# EAGLE design PowerDistribution2022 (EAGLE 9.6.2)
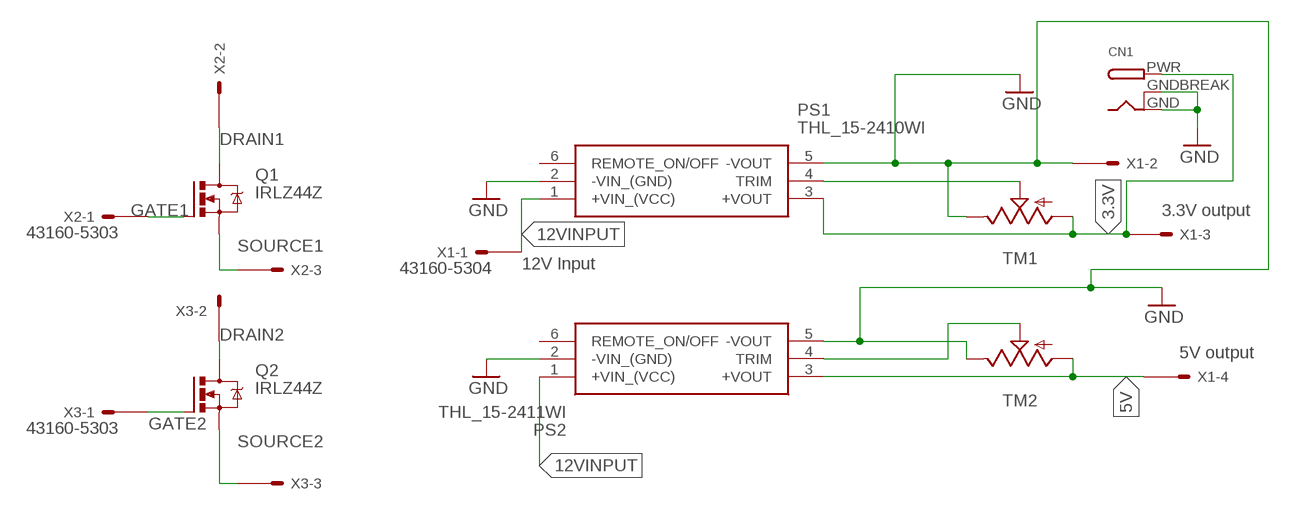
[diagram p0: schematic, sheet 1]

## Parts
CN1  DCBARRELPTH  [DCJACK_2MM_PTH]
PS1  THL_15-2410WI  [THL152410WI]
PS2  THL_15-2411WI  [THL152411WI]
Q1  IRLZ44Z  [TO220BH]
Q2  IRLZ44Z  [TO220BH]
TM1  TRIM  [6MM]
TM2  TRIM  [6MM]
X1  43160-5304  [43160-XX04]
X2  43160-5303  [43160-XX03]
X3  43160-5303  [43160-XX03]

## Nets
3.3V: CN1.PWR PS1.3(+VOUT) TM1.A X1.3@1(-3:S)
5V: PS2.3(+VOUT) TM2.A X1.4@1(-4:S)
12VINPUT: PS1.1(+VIN_(VCC)) PS2.1(+VIN_(VCC)) X1.1@1(-1:S)
DRAIN1: Q1.D X2.2@1(-2:S)
DRAIN2: Q2.D X3.2@1(-2:S)
GATE1: Q1.G X2.1@1(-1:S)
GATE2: Q2.G X3.1@1(-1:S)
GND: CN1.GND CN1.GNDBREAK PS1.2(-VIN_(GND)) PS1.5(-VOUT) PS2.2(-VIN_(GND)) PS2.5(-VOUT) TM1.E TM2.E X1.2@1(-2:S)
N$1: PS1.4(TRIM) TM1.S
N$4: PS2.4(TRIM) TM2.S
SOURCE1: Q1.S X2.3@1(-3:S)
SOURCE2: Q2.S X3.3@1(-3:S)
Unconnected: PS1.6(REMOTE_ON/OFF) PS2.6(REMOTE_ON/OFF) X1.1@2(-1:S) X1.2@2(-2:S) X1.3@2(-3:S) X1.4@2(-4:S) X2.1@2(-1:S) X2.2@2(-2:S) X2.3@2(-3:S) X3.1@2(-1:S) X3.2@2(-2:S) X3.3@2(-3:S)

## Notes on the sheet
- 3.3V output
- 12V Input
- 5V output

## Library data of the parts
CN1 = adafruit:DCBARREL: 2.0mm DC Barrel Jack DCJACK_2MM_PTH - Through Hole Jack (4UConnector: 05537)
PS1 = SamacSys_Parts:THL_15-2410WI: 15 Watt DC/DC converter, industrial, 4:1 input, cost efficient design, encapsulated, 1" x 1" metal package Source: Datasheet <https://tracopower.com/thl15wi-datasheet/>; DESCRIPTION: 15 Watt DC/DC converter, industrial, 4:1 input, cost efficient design, encapsulated, 1" x 1" metal package; HEIGHT: 10.66mm; MANUFACTURER_NAME: Traco Power; MANUFACTURER_PART_NUMBER: THL 15-2410WI; MOUSER_PART_NUMBER: 495-THL15-2410WI; MOUSER_PRICE-STOCK: https://www.mouser.co.uk/ProductDetail/TRACO-Power/THL-15-2410WI/?qs=vLWxofP3U2zUD2qGlvCiuw%3D%3D
PS2 = SamacSys_Parts:THL_15-2411WI: 15 Watt DC/DC converter, industrial, 4:1 input, cost efficient design, encapsulated, 1" x 1" metal package Source: Datasheet <https://tracopower.com/thl15wi-datasheet/>; DESCRIPTION: 15 Watt DC/DC converter, industrial, 4:1 input, cost efficient design, encapsulated, 1" x 1" metal package; HEIGHT: 10.66mm; MANUFACTURER_NAME: Traco Power; MANUFACTURER_PART_NUMBER: THL 15-2411WI; MOUSER_PART_NUMBER: 495-THL15-2411WI; MOUSER_PRICE-STOCK: https://www.mouser.co.uk/ProductDetail/TRACO-Power/THL-15-2411WI?qs=vLWxofP3U2zTxW0y6%2FAPOg%3D%3D
Q1 Q2 = IRLZ44Z:IRLZ44Z: N-Channel HEXFET® Power MOSFET Logic Level AUTOMOTIVE MOSFET Source: http://www.irf.com/product-info/datasheets/data/irlz44zpbf.pdf Check availability <https://pricing.snapeda.com/parts/IRLZ44Z/Infineon%20Technologies/view-part?ref=eda>; AVAILABILITY: In Stock; DESCRIPTION: N-Channel 55 V 51A (Tc) 80W (Tc) Through Hole TO-220AB; MF: Infineon Technologies; MP: IRLZ44Z; PACKAGE: TO-220 Vishay; PRICE: None; PURCHASE-URL: https://pricing.snapeda.com/search/part/IRLZ44Z/?ref=eda
TM1 TM2 = adafruit:TRIM
X1 = con-molex:43160-*04: SDA-43160 Connector Source: http://www.molex.com/pdm_docs/sd/431601306_sd.pdf; MF: MOLEX; MPN: 43160-5304; OC_FARNELL: unknown; OC_NEWARK: 92M1500
X2 X3 = con-molex:43160-*03: SDA-43160 Connector Source: http://www.molex.com/pdm_docs/sd/431601306_sd.pdf; MF: MOLEX; MPN: 43160-5303; OC_FARNELL: unknown; OC_NEWARK: 92M1499

## Board
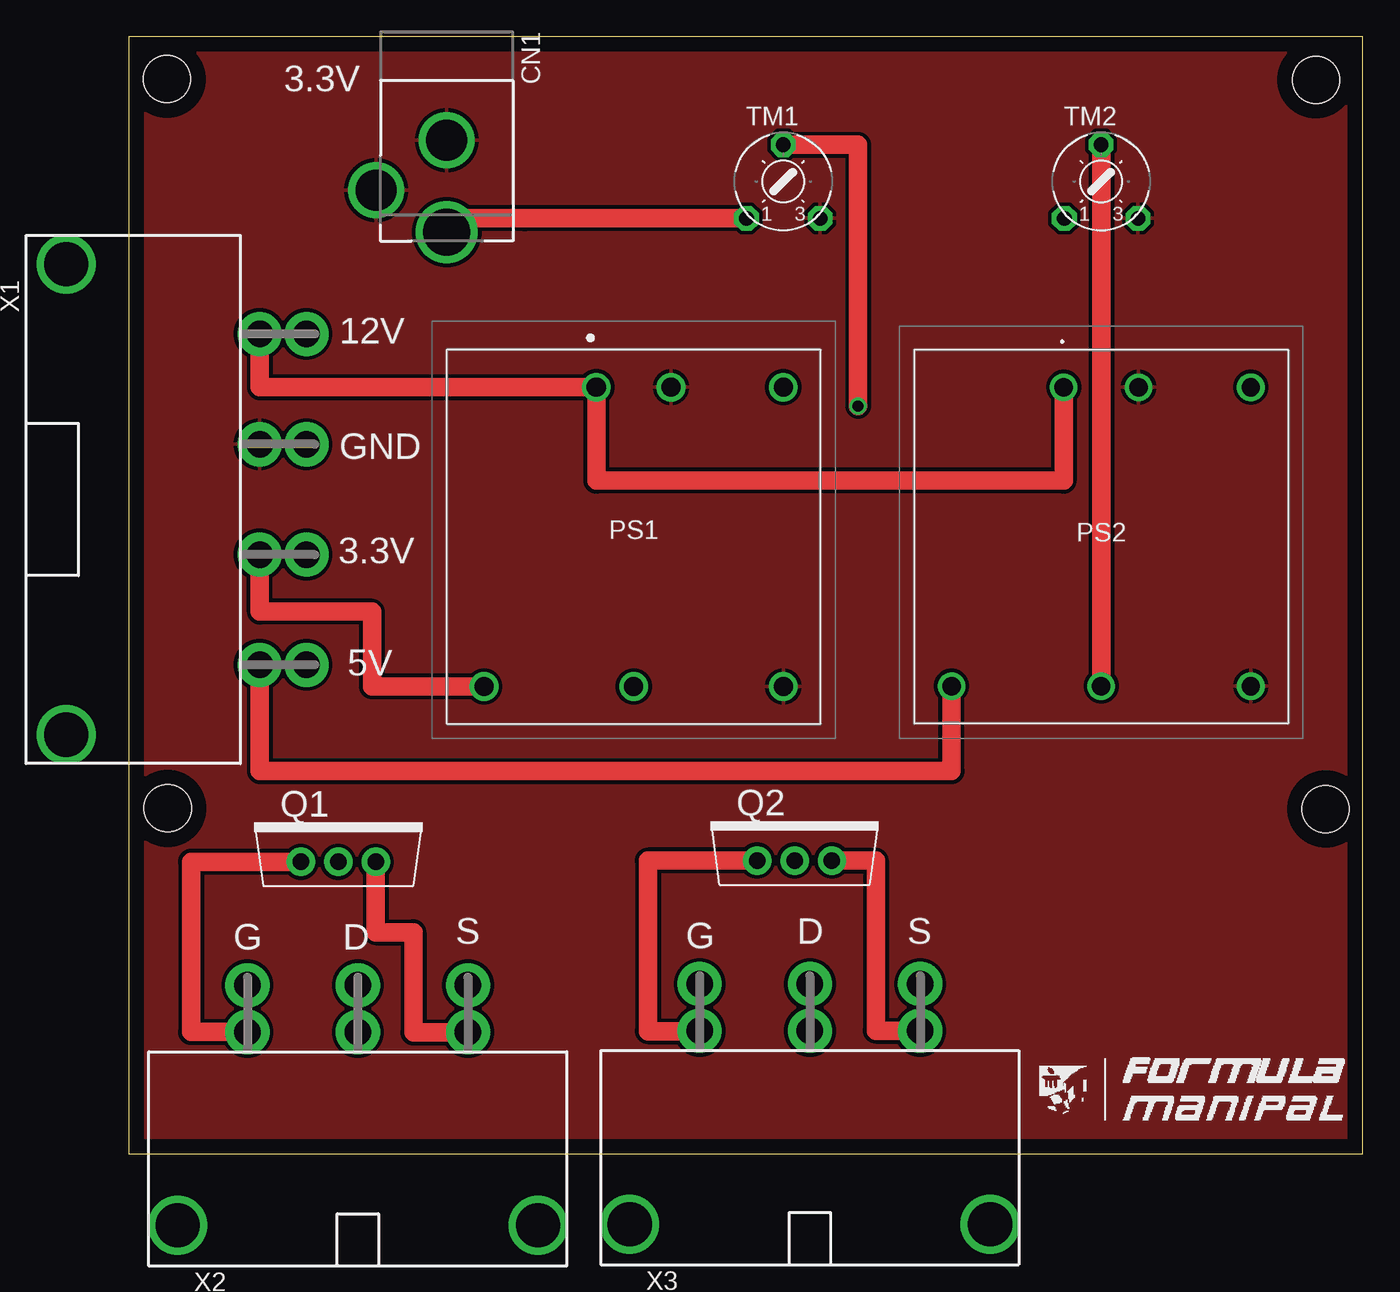
[diagram p1: board, top side]
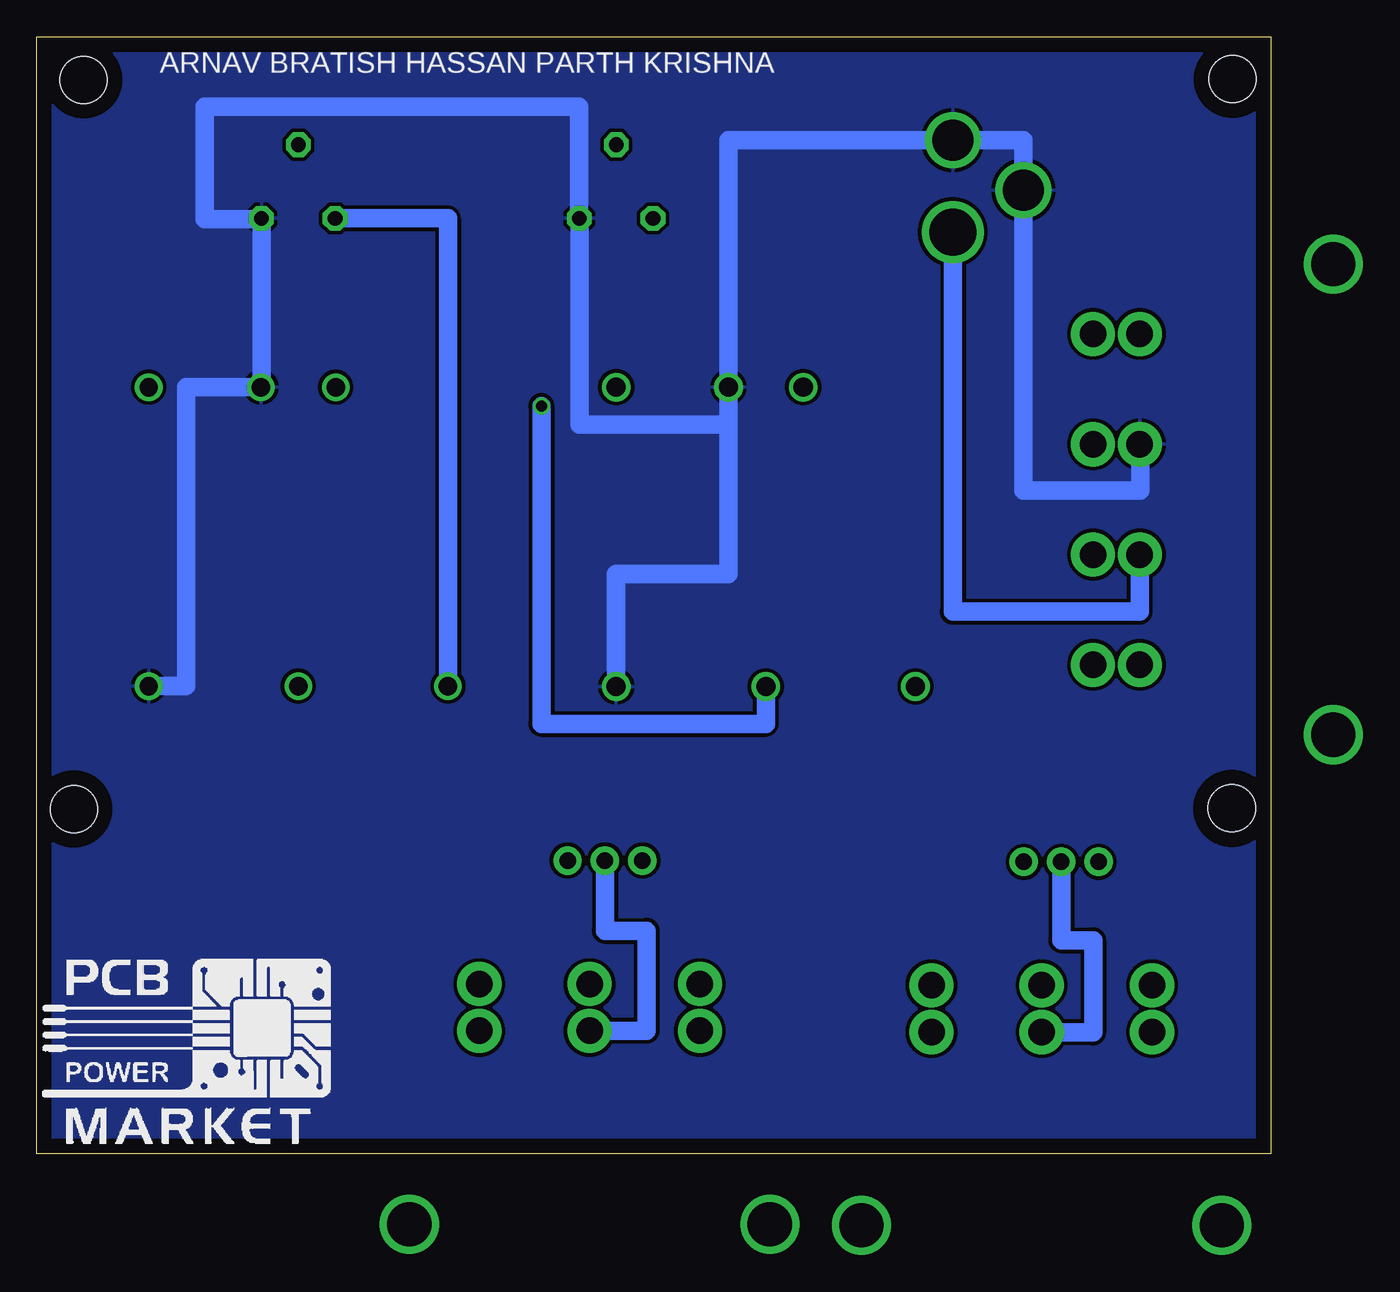
[diagram p2: board, bottom side, seen from below]

Size 83.8 x 75.87 mm. Coordinates in mm from the lower left corner, seen from the top.
Outline: 0,0 83.8,0 83.8,75.87 0,75.87 0,0
Copper layers (1*16): Top 0.035mm / dielectric 1.5mm / Bottom 0.035mm
Design rules "default *": minimum track width 10mil, minimum drill 0.35mm, track to track 10mil, track to pad 10mil, pad to pad 10mil, via to via 10mil, smd to smd 10mil, copper to edge 40mil, drill to drill 10mil, minimum pad ring 10mil, minimum via ring 8mil, stop-mask expansion 4mil, vias tented up to drill 0mil, thermal gap 10mil
Holes 3.2 mm at 81.28,23.42 2.64,23.47 80.62,72.95 2.59,73

### Footprints (pad centres in the part's own frame; a part is rotated, then mirrored left to right if it is on the bottom)
DCJACK_2MM_PTH = drill 2.8: GND 0,7.35; GNDBREAK 4.8,10.75 | drill 3.2: PWR 0,13.6
THL152410WI = drill 1.3 pad 1.95: 1 0,0; 2 -5.08,0; 3 7.62,20.32; 4 -2.54,20.32; 5 -12.7,20.32; 6 -12.7,0
THL152411WI = drill 1.25 pad 1.875: 1 0,0; 2 5.08,0; 3 -7.62,-20.3; 4 2.54,-20.3; 5 12.7,-20.3; 6 12.7,0
TO220BH = drill 1.118 pad 1.93: D 0,0; G -2.54,0; S 2.54,0
6MM = drill 1 pad 1.676 octagon: A -2.5,-2.5; E 2.5,-2.5; S 0,2.5
43160-XX04 = drill 1.8 pad 3: 1@1 -11.235,0; 1@2 -11.235,3.18; 2@1 -3.745,0; 2@2 -3.745,3.18; 3@1 3.745,0; 3@2 3.745,3.18; 4@1 11.235,0; 4@2 11.235,3.18 | drill 3 pad 3.4: M1 -15.985,-13.13; M2 15.985,-13.13
43160-XX03 = drill 1.8 pad 3: 1@1 -7.49,0; 1@2 -7.49,3.18; 2@1 0,0; 2@2 0,3.18; 3@1 7.49,0; 3@2 7.49,3.18 | drill 3 pad 3.4: M1 -12.24,-13.13; M2 12.24,-13.13

### Placement (x,y rotation side)
CN1  21.59,76.2 180 top
PS1  31.75,52.07 180 top
PS2  63.5,52.07 0 top
Q1  14.22,19.84 0 top
Q2  45.21,19.93 0 top
TM1  44.45,66.04 0 top
TM2  66.04,66.04 0 top
X1  8.89,44.45 270 top
X2  15.55,8.27 0 top
X3  46.26,8.36 0 top

### Tracks (layer width: path | path; a pad name or v marks a point on that pad's centre or on a via)
3.3V
  Top 1.27: PS1.3 16.51,31.75 16.51,36.83 8.89,36.83 X1.3@1 | TM1.A 26.89,63.54 | 26.89,63.54 21.59,63.54 CN1.PWR | 26.89,63.54
  Bottom 1.27: X1.3@1 8.89,36.83 21.59,36.83 CN1.PWR
5V
  Top 1.27: X1.4@1 8.89,25.99 55.88,25.99 PS2.3
  Bottom 1.27: TM2.A 55.88,63.54 PS2.3
12VINPUT
  Top 1.27: X1.1@1 8.89,52.07 PS1.1 31.75,45.72 63.5,45.72 PS2.1
DRAIN1
  Bottom 1.27: Q1.D 14.22,14.51 12.05,14.51 12.05,8.24 15.55,8.24 X2.2@1
DRAIN2
  Bottom 1.27: Q2.D 45.21,15.16 42.38,15.16 42.38,8.36 X3.2@1
GATE1
  Top 1.27: Q1.G 4.23,19.84 4.23,8.27 X2.1@1
GATE2
  Top 1.27: Q2.G 35.25,19.93 35.25,8.33 38.77,8.33 X3.1@1
GND
  Bottom 1.27: PS1.2 36.83,68.85 CN1.GND 16.79,68.85 CN1.GNDBREAK 16.79,45.07 8.86,45.07 8.86,48.2 X1.2@1 | PS1.2 36.83,49.53 46.95,49.53 TM1.E 46.99,63.54 46.99,71.12 72.39,71.12 72.39,63.5 68.54,63.5 TM2.E 68.54,52.07 PS2.2 73.66,52.07 73.66,31.77 PS2.5 | PS1.2 36.83,39.37 44.45,39.37 PS1.5
  pour Bottom: 0,76.2 0,0.15 83.82,0.15 83.82,76.2
  pour Top: 0,74.93 0,0 83.82,0 83.82,76.2 81.28,76.2 0,76.2
N$1  (via drill 0.75)
  Top 1.27: TM1.S 49.53,68.54 v49.53,50.8
  Bottom 1.27: v49.53,50.8 49.53,29.21 34.29,29.21 PS1.4
N$4
  Top 1.27: TM2.S PS2.4
SOURCE1
  Top 1.27: Q1.S 16.77,15.04 19.33,15.04 19.33,8.24 23.04,8.24 X2.3@1
SOURCE2
  Top 1.27: Q2.S 50.74,19.93 50.74,8.36 X3.3@1

### Text on the board
tPlace: 3.3V | 12V | GND | 3.3V | 5V | G | D | S | G | D | S
bPlace: ARNAV BRATISH HASSAN PARTH KRISHNA